# Altium project PCB_Project.PrjPcb (part 4 of 5)
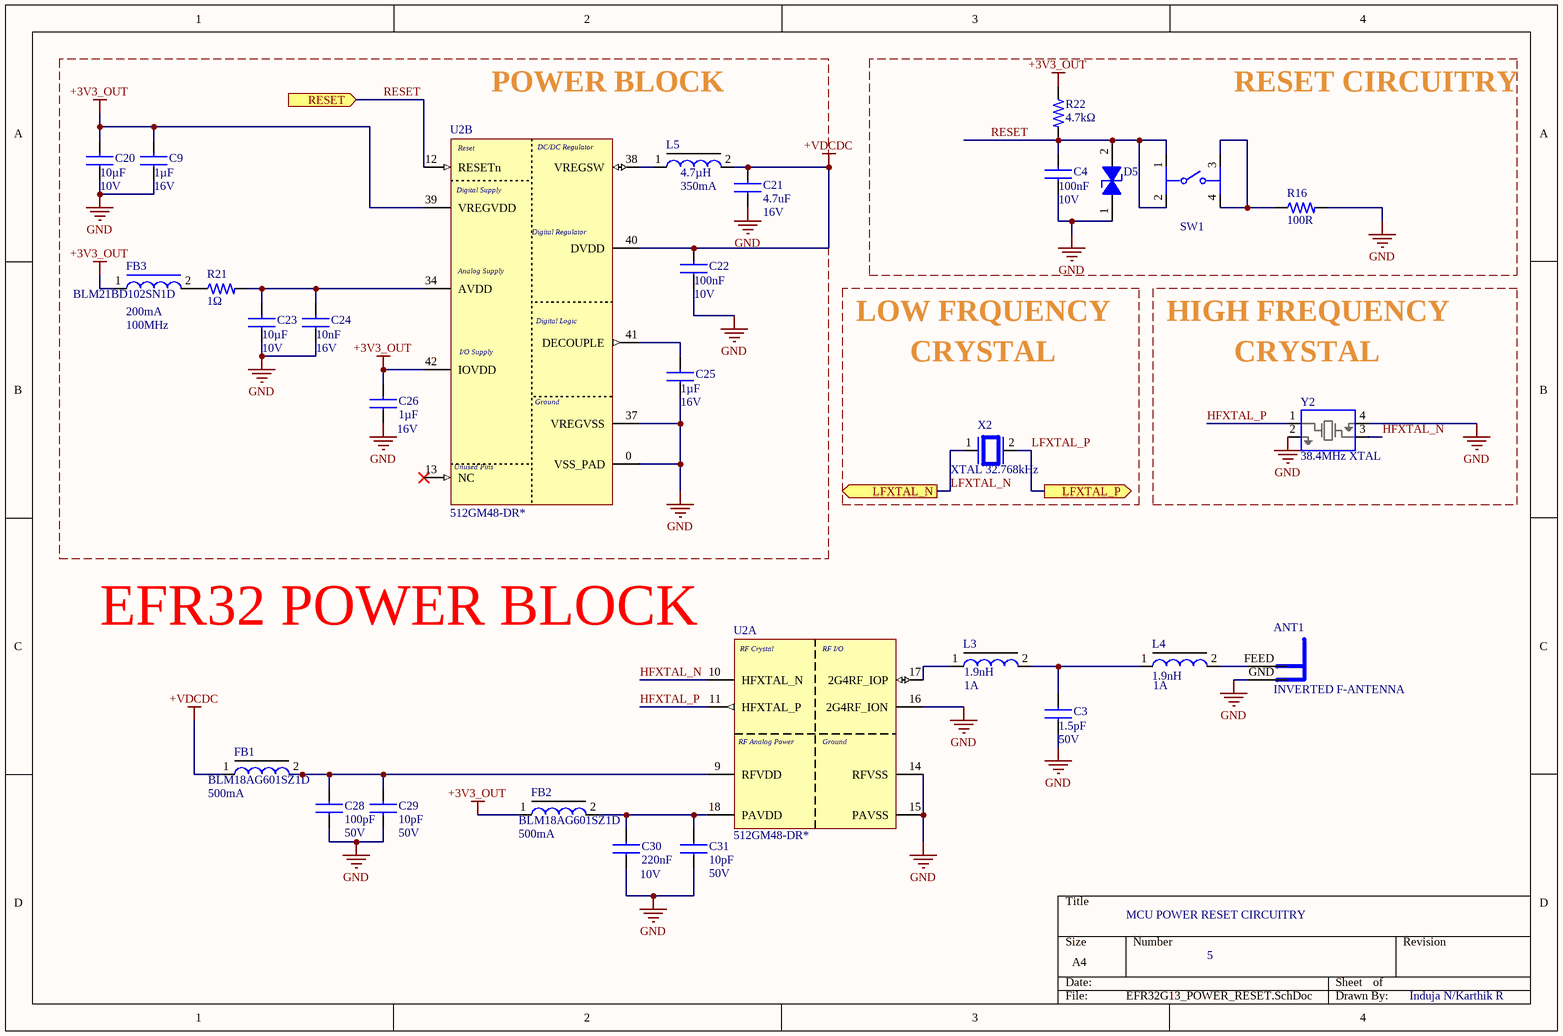
[diagram p9: EFR32G13_POWER_RESET.SchDoc]

## Sheet EFR32G13_POWER_RESET.SchDoc (continued)
### Library data of the parts
C3 = CAP 1.5pF 50V 0402: Ceramic Capacitor, Multilayer, Ceramic, 50V, 3.33% +Tol, 3.33% -Tol, C0G, 30ppm/Cel TC, 0.0000015uF, Surface Mount, 0402; Manufacturer: Murata; Manufacturer Part Number: GJM1555C1H1R5WB01D; Multilayer: Yes; Supplier: Digikey; Supplier Part Number: 490-11199-1-ND; RoHS: Yes; Category: Ceramic Capacitors; Stock: 52422; Pricing: 1=0.16, 10=0.091, 50=0.0634, 100=0.0549, 500=0.04062, 1000=0.03616, 2500=0.03144, 5000=0.02857 (USD); Mounting Technology: Surface Mount; Pins: 2; Dielectric Material: Ceramic; Package Shape: Rectangular; Case/Package: 0402; Terminal Finish: Nickel; Min Operating Temperature: -55°C; Max Operating Temperature: 125°C; JESD-609 Code: e3; Capacitor Type: Ceramic; Tolerance  (fill in as +-): 3.33%; Package Style: SMTMeter; Packaging: Tape and Reel; Tolerance (fill in as +-): 3.33%; Temperature Characteristics Code: C0G; Termination: Wraparound; Length: 1mm; Width: 0.5mm; Height: 0.5mm; Reach SVHC Compliant: Yes; RoHS Compliant: Yes; ComponentLink1URL: https://datasheet.ciiva.com:443/pdfs/VipMasterIC/IC/MURE/MURE-S-A0004378008/MURE-S-A0004383770-1.pdf?src-supplier=IHS+Markit; ComponentLink1Description: https://datasheet.ciiva.com:443/pdfs/VipMasterIC/IC/MURE/MURE-S-A0004378008/MURE-S-A0004383770-1.pdf?src-supplier=IHS+Markit; ComponentLink2URL: https://datasheet.ciiva.com/18183/getdatasheetpartid-312921-18183825.pdf?src-supplier=Verical; ComponentLink2Description: https://datasheet.ciiva.com/18183/getdatasheetpartid-312921-18183825.pdf?src-supplier=Verical
C4 C22 = CAP 0.1uF 0603: 0603 0.1 uF 10 V ±10% Tolerance X7R SMT Multilayer Ceramic Chip Capacitor; Manufacturer: Vishay; Manufacturer Part Number: VJ0603Y104KXQCW1BC; Supplier: Newark; Supplier Part Number: 77AK2911; RoHS: Compliant; Category: Ceramic Capacitors; Stock: 20000; Pricing: 4000=0.028, 8000=0.026 (USD); Case/Package: 0603; Case Code (Imperial): 0603; Case Code (Metric): 1608; China RoHS: Compliant; Depth: 800µm; Dielectric: X7R; Dielectric Material: Ceramic; Height: 870µm; Lead Free: Lead Free; Length: 1.6mm; Lifecycle Status: Production; Max Operating Temperature: 125°C; Min Operating Temperature: -55°C; Mounting Technology: Surface Mount; Number of Terminals: 2; REACH SVHC: Yes; Schedule B: 8532240020, 8532240020|8532240020|8532240020|8532240020|8532240020; Termination: SMD/SMT; Tolerance: 10%; Width: 800µm; ComponentLink1URL: https://datasheet.octopart.com:443/VJ0603Y104KXQCW1BC-Vishay-datasheet-182138897.pdf?src-supplier=IHS; ComponentLink1Description: https://datasheet.octopart.com:443/VJ0603Y104KXQCW1BC-Vishay-datasheet-182138897.pdf?src-supplier=IHS; ComponentLink2URL: https://datasheet.octopart.com:443/VJ0603Y104KXQCW1BC-Vishay-datasheet-182137611.pdf?src-supplier=IHS; ComponentLink2Description: https://datasheet.octopart.com:443/VJ0603Y104KXQCW1BC-Vishay-datasheet-182137611.pdf?src-supplier=IHS; ComponentLink3URL: https://datasheet.octopart.com:443/VJ0603Y104KXQCW1BC-Vishay-datasheet-79783898.pdf?src-supplier=Future+Electronics; ComponentLink3Description: https://datasheet.octopart.com:443/VJ0603Y104KXQCW1BC-Vishay-datasheet-79783898.pdf?src-supplier=Future+Electronics; ComponentLink4URL: https://datasheet.octopart.com/VJ0603Y104KXQCW1BC-Vishay-datasheet-13530908.pdf; ComponentLink4Description: https://datasheet.octopart.com/VJ0603Y104KXQCW1BC-Vishay-datasheet-13530908.pdf; ComponentLink5URL: https://datasheet.octopart.com/VJ0603Y104KXQCW1BC-Vishay-datasheet-13436109.pdf; ComponentLink5Description: https://datasheet.octopart.com/VJ0603Y104KXQCW1BC-Vishay-datasheet-13436109.pdf; ComponentLink6URL: https://datasheet.octopart.com/VJ0603Y104KXQCW1BC-Vishay-datasheet-13168783.pdf; ComponentLink6Description: https://datasheet.octopart.com/VJ0603Y104KXQCW1BC-Vishay-datasheet-13168783.pdf; ComponentLink7URL: https://datasheet.octopart.com/VJ0603Y104KXQCW1BC-Vishay-datasheet-13134009.pdf; ComponentLink7Description: https://datasheet.octopart.com/VJ0603Y104KXQCW1BC-Vishay-datasheet-13134009.pdf; ComponentLink8URL: https://datasheet.octopart.com/VJ0603Y104KXQCW1BC-Vishay-datasheet-13055807.pdf; ComponentLink8Description: https://datasheet.octopart.com/VJ0603Y104KXQCW1BC-Vishay-datasheet-13055807.pdf; ComponentLink9URL: https://datasheet.octopart.com/VJ0603Y104KXQCW1BC-Vishay-datasheet-13029350.pdf; ComponentLink9Description: https://datasheet.octopart.com/VJ0603Y104KXQCW1BC-Vishay-datasheet-13029350.pdf; ComponentLink10URL: https://datasheet.octopart.com/VJ0603Y104KXQCW1BC-Vishay-datasheet-12584848.pdf; ComponentLink10Description: https://datasheet.octopart.com/VJ0603Y104KXQCW1BC-Vishay-datasheet-12584848.pdf; ComponentLink11URL: https://datasheet.octopart.com/VJ0603Y104KXQCW1BC-Vishay-datasheet-12543093.pdf; ComponentLink11Description: https://datasheet.octopart.com/VJ0603Y104KXQCW1BC-Vishay-datasheet-12543093.pdf; ComponentLink12URL: https://datasheet.octopart.com/VJ0603Y104KXQCW1BC-Vishay-datasheet-12532924.pdf; ComponentLink12Description: https://datasheet.octopart.com/VJ0603Y104KXQCW1BC-Vishay-datasheet-12532924.pdf; ComponentLink13URL: https://datasheet.octopart.com/VJ0603Y104KXQCW1BC-Vishay-datasheet-12519409.pdf; ComponentLink13Description: https://datasheet.octopart.com/VJ0603Y104KXQCW1BC-Vishay-datasheet-12519409.pdf; ComponentLink14URL: https://datasheet.octopart.com/VJ0603Y104KXQCW1BC-Vishay-datasheet-12509873.pdf; ComponentLink14Description: https://datasheet.octopart.com/VJ0603Y104KXQCW1BC-Vishay-datasheet-12509873.pdf; ComponentLink15URL: http://sigma.octopart.com:80/rohs_statement/Vishay-company-15.pdf?src-supplier=Compliance+Statements; ComponentLink15Description: http://sigma.octopart.com:80/rohs_statement/Vishay-company-15.pdf?src-supplier=Compliance+Statements; Supplier 1: DigiKey; Supplier Part Number 1: 720-1689-1-ND
C9 C25 C26 = CAP 1uF 0603: 16V 1uF X7R ±10% 0603 Multilayer Ceramic Capacitors MLCC - SMD/SMT ROHS; Manufacturer: Samsung Electro-Mechanics; Manufacturer Part Number: CL10B105KO8NNNC; Supplier: DigiKey; Supplier Part Number: 1276-1019-1-ND; RoHS: Compliant; Category: Ceramic Capacitors; Stock: 1501586; Pricing: 1=0.08, 10=0.011, 50=0.010, 100=0.0088 (USD); Case/Package: 0603; Case Code (Imperial): 0603; Case Code (Metric): 1608; China RoHS: Compliant; Depth: 800µm; Dielectric: X7R; Dielectric Material: Ceramic; Height: 800µm; Lead Free: Lead Free; Length: 1.6mm; Lifecycle Status: Production; Material: Ceramic; Max Operating Temperature: 125°C; Min Operating Temperature: -55°C; Mounting Technology: Surface Mount; Number of Terminals: 2; Radiation Hardening: No; REACH SVHC: Yes; Schedule B: 8532240020, 8532240020|8532240020, 8532240020|8532240020|8532240020, 8532240020|8532240020|8532240020|8532240020; Thickness: 889µm; Tolerance: 10%; Voltage Rating: 16V; Width: 800µm; ComponentLink1URL: https://datasheet.octopart.com:443/CL10B105KO8NNNC-Samsung-Electro-Mechanics-datasheet-137745070.pdf?src-supplier=IHS; ComponentLink1Description: https://datasheet.octopart.com:443/CL10B105KO8NNNC-Samsung-Electro-Mechanics-datasheet-137745070.pdf?src-supplier=IHS; ComponentLink2URL: https://datasheet.octopart.com/CL10B105KO8NNNC-Samsung-Electro-Mechanics-datasheet-8324245.pdf; ComponentLink2Description: https://datasheet.octopart.com/CL10B105KO8NNNC-Samsung-Electro-Mechanics-datasheet-8324245.pdf; ComponentLink3URL: https://datasheet.octopart.com/CL10B105KO8NNNC-Samsung-Electro-Mechanics-datasheet-97040617.pdf; ComponentLink3Description: https://datasheet.octopart.com/CL10B105KO8NNNC-Samsung-Electro-Mechanics-datasheet-97040617.pdf; ComponentLink4URL: https://datasheet.octopart.com/General-Multilayer-Ceramic-Capacitors-Samsung-datasheet-family-111.pdf; ComponentLink4Description: https://datasheet.octopart.com/General-Multilayer-Ceramic-Capacitors-Samsung-datasheet-family-111.pdf; ComponentLink5URL: https://datasheet.octopart.com:443/CL10B105KO8NNNC-Samsung-Electro-Mechanics-datasheet-116890984.pdf?src-supplier=Future+Electronics; ComponentLink5Description: https://datasheet.octopart.com:443/CL10B105KO8NNNC-Samsung-Electro-Mechanics-datasheet-116890984.pdf?src-supplier=Future+Electronics; ComponentLink6URL: https://datasheet.octopart.com:443/CL10B105KO8NNNC-Samsung-Electro-Mechanics-datasheet-81461852.pdf?src-supplier=Future+Electronics; ComponentLink6Description: https://datasheet.octopart.com:443/CL10B105KO8NNNC-Samsung-Electro-Mechanics-datasheet-81461852.pdf?src-supplier=Future+Electronics; ComponentLink7URL: https://datasheet.octopart.com:443/CL10B105KO8NNNC-Samsung-datasheet-42770397.pdf?src-supplier=Future+Electronics; ComponentLink7Description: https://datasheet.octopart.com:443/CL10B105KO8NNNC-Samsung-datasheet-42770397.pdf?src-supplier=Future+Electronics; ComponentLink8URL: https://datasheet.octopart.com:443/CL10B105KO8NNNC-Samsung-datasheet-26669023.pdf?src-supplier=Future+Electronics; ComponentLink8Description: https://datasheet.octopart.com:443/CL10B105KO8NNNC-Samsung-datasheet-26669023.pdf?src-supplier=Future+Electronics; ComponentLink9URL: https://datasheet.octopart.com:443/CL10B105KO8NNNC-Samsung-Electro-Mechanics-datasheet-149136799.pdf?src-supplier=Future+Electronics; ComponentLink9Description: https://datasheet.octopart.com:443/CL10B105KO8NNNC-Samsung-Electro-Mechanics-datasheet-149136799.pdf?src-supplier=Future+Electronics; ComponentLink10URL: https://datasheet.octopart.com:443/CL10B105KO8NNNC-Samsung-datasheet-151956584.pdf?src-supplier=SOS+electronic; ComponentLink10Description: https://datasheet.octopart.com:443/CL10B105KO8NNNC-Samsung-datasheet-151956584.pdf?src-supplier=SOS+electronic; ComponentLink11URL: https://datasheet.octopart.com:443/CL10B105KO8NNNC-Samsung-Electro-Mechanics-datasheet-11774093.pdf?src-supplier=Arrow+Electronics; ComponentLink11Description: https://datasheet.octopart.com:443/CL10B105KO8NNNC-Samsung-Electro-Mechanics-datasheet-11774093.pdf?src-supplier=Arrow+Electronics; ComponentLink12URL: https://datasheet.octopart.com:443/CL10B105KO8NNNC-Samsung-datasheet-59220082.pdf?src-supplier=TME; ComponentLink12Description: https://datasheet.octopart.com:443/CL10B105KO8NNNC-Samsung-datasheet-59220082.pdf?src-supplier=TME; ComponentLink13URL: http://sigma.octopart.com:80/rohs_certificate/General-Multilayer-Ceramic-Capacitors-Samsung-family-110.pdf?src-supplier=Compliance+Statements; ComponentLink13Description: http://sigma.octopart.com:80/rohs_certificate/General-Multilayer-Ceramic-Capacitors-Samsung-family-110.pdf?src-supplier=Compliance+Statements; ComponentLink14URL: http://sigma.octopart.com:80/rohs_statement/General-Multilayer-Ceramic-Capacitors-Samsung-family-132.pdf?src-supplier=Compliance+Statements; ComponentLink14Description: http://sigma.octopart.com:80/rohs_statement/General-Multilayer-Ceramic-Capacitors-Samsung-family-132.pdf?src-supplier=Compliance+Statements; ComponentLink15URL: http://sigma.octopart.com:80/reach_statement/General-Multilayer-Ceramic-Capacitors-Samsung-family-133.pdf?src-supplier=Compliance+Statements; ComponentLink15Description: http://sigma.octopart.com:80/reach_statement/General-Multilayer-Ceramic-Capacitors-Samsung-family-133.pdf?src-supplier=Compliance+Statements; Supplier 1: DigiKey; Supplier Part Number 1: 1276-1019-1-ND
  C9 C26: Voltage Rating (DC): 16V
  C25: Voltage: 16V
C20 C23 = CAP 10uF 0603: 10V 10uF X7R ±10% 0603 Multilayer Ceramic Capacitors MLCC - SMD/SMT ROHS; Manufacturer: Murata; Manufacturer Part Number: GRM188Z71A106KA73D; Manufacturer Lifecycle Status: IN PRODUCTION; Supplier: Avnet; Supplier Part Number: GRM188Z71A106KA73D; RoHS: Compliant; Category: Ceramic Capacitors; Stock: 36000; Pricing: 4000=0.04684, 8000=0.04661, 16000=0.04637, 24000=0.04613, 32000=0.04589 (USD); Case/Package: 0603; Dielectric Material: Ceramic; Height: 800µm; Length: 1.6mm; Lifecycle Status: Production; Material: Ceramic; Max Operating Temperature: 125°C; Min Operating Temperature: -55°C; Mounting Technology: Surface Mount; Number of Terminals: 2; REACH SVHC: Yes; Schedule B: 8532240020, 8532240020|8532240020|8532240020|8532240020|8532240020; Thickness: 800µm; Tolerance: 10%; Voltage Rating (DC): 10V; Width: 800µm; ComponentLink1URL: https://datasheet.octopart.com:443/GRM188Z71A106KA73D-Murata-datasheet-141276001.pdf?src-supplier=Geoflip; ComponentLink1Description: https://datasheet.octopart.com:443/GRM188Z71A106KA73D-Murata-datasheet-141276001.pdf?src-supplier=Geoflip; ComponentLink2URL: https://datasheet.octopart.com:443/GRM188Z71A106KA73D-Murata-datasheet-165579666.pdf?src-supplier=TME; ComponentLink2Description: https://datasheet.octopart.com:443/GRM188Z71A106KA73D-Murata-datasheet-165579666.pdf?src-supplier=TME; ComponentLink3URL: https://datasheet.octopart.com:443/GRM188Z71A106KA73D-Murata-datasheet-140705911.pdf?src-supplier=Ciiva; ComponentLink3Description: https://datasheet.octopart.com:443/GRM188Z71A106KA73D-Murata-datasheet-140705911.pdf?src-supplier=Ciiva; ComponentLink4URL: https://datasheet.octopart.com:443/GRM188Z71A106KA73D-Murata-datasheet-138743429.pdf?src-supplier=Ciiva; ComponentLink4Description: https://datasheet.octopart.com:443/GRM188Z71A106KA73D-Murata-datasheet-138743429.pdf?src-supplier=Ciiva; ComponentLink5URL: http://sigma.octopart.com:80/reach_statement/Murata-company-16.pdf?src-supplier=Compliance+Statements; ComponentLink5Description: http://sigma.octopart.com:80/reach_statement/Murata-company-16.pdf?src-supplier=Compliance+Statements; Supplier 1: DigiKey; Supplier Part Number 1: 490-GRM188Z71A106KA73DCT-ND
C21 = CAP 4.7uF 16V 0603: 4.7 ÂµF Â±10% 16V Ceramic Capacitor X5R 0603 (1608 Metric); MF: Samsung Electro-Mechanics; MP: CL10A475KO8NNNC; SnapEDA_Link: https://www.snapeda.com/parts/CL10A475KO8NNNC/Samsung/view-part/?ref=snap; Package: SMD-2 Samsung; Check_prices: https://www.snapeda.com/parts/CL10A475KO8NNNC/Samsung/view-part/?ref=eda; Supplier 1: DigiKey; Supplier Part Number 1: 1276-1784-1-ND
C24 = CAP 10nF 0603: Multilayer Ceramic Capacitors MLCC - SMD/SMT 16V 0.01uF X7R 0603 10% AEC-Q200; Manufacturer: KEMET; Manufacturer Part Number: C0603C103K4RECAUTO; Supplier: Newark; Supplier Part Number: 76AH8427; RoHS: Compliant; Category: Ceramic Capacitors; Stock: 3130; Pricing: 1=0.02, 25=0.02, 50=0.02, 100=0.02, 250=0.02, 500=0.02, 1000=0.02 (USD); China RoHS: Compliant; Dielectric: X7R; Dielectric Material: Ceramic; Height: 800µm; Length: 1.6mm; Lifecycle Status: Production; Max Operating Temperature: 125°C; Min Operating Temperature: -55°C; Mounting Technology: Surface Mount; Number of Terminals: 2; REACH SVHC: Yes; Schedule B: 8532240020, 8532240020|8532240020, 8532240020|8532240020|8532240020, 8532240020|8532240020|8532240020|8532240020; Width: 800µm; ComponentLink1URL: https://datasheet.octopart.com:443/C0603C103K4RECAUTO-KEMET-datasheet-178568699.pdf?src-supplier=IHS; ComponentLink1Description: https://datasheet.octopart.com:443/C0603C103K4RECAUTO-KEMET-datasheet-178568699.pdf?src-supplier=IHS; ComponentLink2URL: https://datasheet.octopart.com:443/C0603C103K4RECAUTO-KEMET-datasheet-189767465.pdf?src-supplier=ODG+(Origin+Data+Global); ComponentLink2Description: https://datasheet.octopart.com:443/C0603C103K4RECAUTO-KEMET-datasheet-189767465.pdf?src-supplier=ODG+(Origin+Data+Global); ComponentLink3URL: https://datasheet.octopart.com:443/C0603C103K4RECAUTO-KEMET-datasheet-149521825.pdf?src-supplier=Farnell; ComponentLink3Description: https://datasheet.octopart.com:443/C0603C103K4RECAUTO-KEMET-datasheet-149521825.pdf?src-supplier=Farnell; ComponentLink4URL: https://datasheet.octopart.com:443/C0603C103K4RECAUTO-KEMET-datasheet-153706760.pdf?src-supplier=Farnell; ComponentLink4Description: https://datasheet.octopart.com:443/C0603C103K4RECAUTO-KEMET-datasheet-153706760.pdf?src-supplier=Farnell; ComponentLink5URL: https://datasheet.octopart.com:443/C0603C103K4RECAUTO-KEMET-datasheet-153410967.pdf?src-supplier=Electro+Sonic; ComponentLink5Description: https://datasheet.octopart.com:443/C0603C103K4RECAUTO-KEMET-datasheet-153410967.pdf?src-supplier=Electro+Sonic; ComponentLink6URL: https://datasheet.octopart.com:443/C0603C103K4RECAUTO-KEMET-datasheet-176334325.pdf?src-supplier=Newark; ComponentLink6Description: https://datasheet.octopart.com:443/C0603C103K4RECAUTO-KEMET-datasheet-176334325.pdf?src-supplier=Newark; ComponentLink7URL: https://datasheet.octopart.com:443/C0603C103K4RECAUTO-KEMET-datasheet-158241778.pdf?src-supplier=TME; ComponentLink7Description: https://datasheet.octopart.com:443/C0603C103K4RECAUTO-KEMET-datasheet-158241778.pdf?src-supplier=TME; Supplier 1: DigiKey; Supplier Part Number 1: 399-17880-1-ND
C28 = CAP 100pF 0603: 50V 100pF NP0 ±5% 0603 Multilayer Ceramic Capacitors MLCC - SMD/SMT ROHS; Manufacturer: Yageo Group; Manufacturer Part Number: CC0603JRNPO9BN101; Dielectric: C0G; Insulation Resistance: 100GΩ; Temperature Coefficient: 30ppm/°C; Supplier: Avnet; Supplier Part Number: CC0603JRNPO9BN101; RoHS: Compliant; Category: Ceramic Capacitors; Stock: 1204000; Pricing: 4000=0.0038, 8000=0.00371, 16000=0.00364, 24000=0.00357, 32000=0.00351 (USD); Case/Package: 0603; Case Code (Imperial): 0603; China RoHS: Compliant; Composition: Ceramic; Depth: 800µm; Dielectric Material: Ceramic; Halogen Free: Halogen Free; Height: 800µm; Lead Free: Lead Free; Length: 1.6mm; Lifecycle Status: Production; Max Operating Temperature: 125°C; Min Operating Temperature: -55°C; Mounting Technology: Surface Mount; Pins: 2; Number of Terminals: 2; Radiation Hardening: No; REACH SVHC: Yes; Schedule B: 8532240020, 8532240020|8532240020|8532240020|8532240020|8532240020|8532240020|8532240020|8532240020|8532240020|8532240020|8532240020|8532240020|8532240020|8532240020|8532240020|8532240020|8532240020|8532240020|8532240020|8532240020|8532240020|8532240020|8532240020|85; Termination: SMD/SMT; Thickness: 889µm; Tolerance: 5%; Voltage: 50V; Voltage Rating: 50V; Voltage Rating (AC): 50V; Width: 800µm; ComponentLink1URL: https://datasheet.octopart.com:443/CC0603JRNPO9BN101-Yageo-datasheet-182140217.pdf?src-supplier=IHS; ComponentLink1Description: https://datasheet.octopart.com:443/CC0603JRNPO9BN101-Yageo-datasheet-182140217.pdf?src-supplier=IHS; ComponentLink2URL: https://datasheet.octopart.com:443/CC0603JRNPO9BN101-Yageo-datasheet-78855684.pdf?src-supplier=Upverter; ComponentLink2Description: https://datasheet.octopart.com:443/CC0603JRNPO9BN101-Yageo-datasheet-78855684.pdf?src-supplier=Upverter; ComponentLink3URL: https://datasheet.octopart.com:443/CC0603JRNPO9BN101-Yageo-datasheet-10406438.pdf?src-supplier=element14+APAC; ComponentLink3Description: https://datasheet.octopart.com:443/CC0603JRNPO9BN101-Yageo-datasheet-10406438.pdf?src-supplier=element14+APAC; ComponentLink4URL: https://datasheet.octopart.com:443/CC0603JRNPO9BN101-Yageo-datasheet-151948684.pdf?src-supplier=Newark; ComponentLink4Description: https://datasheet.octopart.com:443/CC0603JRNPO9BN101-Yageo-datasheet-151948684.pdf?src-supplier=Newark; ComponentLink5URL: https://datasheet.octopart.com:443/CC0603JRNPO9BN101-Yageo-datasheet-24578986.pdf?src-supplier=Newark; ComponentLink5Description: https://datasheet.octopart.com:443/CC0603JRNPO9BN101-Yageo-datasheet-24578986.pdf?src-supplier=Newark; ComponentLink6URL: https://datasheet.octopart.com:443/CC0603JRNPO9BN101-Phycomp-datasheet-504625.pdf?src-supplier=Newark; ComponentLink6Description: https://datasheet.octopart.com:443/CC0603JRNPO9BN101-Phycomp-datasheet-504625.pdf?src-supplier=Newark; ComponentLink7URL: https://datasheet.octopart.com:443/CC0603JRNPO9BN101-Yageo-datasheet-181968162.pdf?src-supplier=Newark; ComponentLink7Description: https://datasheet.octopart.com:443/CC0603JRNPO9BN101-Yageo-datasheet-181968162.pdf?src-supplier=Newark; ComponentLink8URL: https://datasheet.octopart.com:443/CC0603JRNPO9BN101-Yageo-datasheet-181968163.pdf?src-supplier=Newark; ComponentLink8Description: https://datasheet.octopart.com:443/CC0603JRNPO9BN101-Yageo-datasheet-181968163.pdf?src-supplier=Newark; ComponentLink9URL: https://datasheet.octopart.com:443/CC0603JRNPO9BN101-Yageo-datasheet-67645495.pdf?src-supplier=Newark; ComponentLink9Description: https://datasheet.octopart.com:443/CC0603JRNPO9BN101-Yageo-datasheet-67645495.pdf?src-supplier=Newark; ComponentLink10URL: https://datasheet.octopart.com:443/CC0603JRNPO9BN101-Phycomp-datasheet-5321569.pdf?src-supplier=element14; ComponentLink10Description: https://datasheet.octopart.com:443/CC0603JRNPO9BN101-Phycomp-datasheet-5321569.pdf?src-supplier=element14; ComponentLink11URL: https://datasheet.octopart.com:443/CC0603JRNPO9BN101-Yageo-datasheet-8817079.pdf?src-supplier=element14; ComponentLink11Description: https://datasheet.octopart.com:443/CC0603JRNPO9BN101-Yageo-datasheet-8817079.pdf?src-supplier=element14; ComponentLink12URL: https://datasheet.octopart.com:443/CC0603JRNPO9BN101-Yageo-datasheet-8324240.pdf?src-supplier=element14; ComponentLink12Description: https://datasheet.octopart.com:443/CC0603JRNPO9BN101-Yageo-datasheet-8324240.pdf?src-supplier=element14; ComponentLink13URL: https://datasheet.octopart.com:443/CC0603JRNPO9BN101-Yageo-datasheet-65873193.pdf?src-supplier=Farnell; ComponentLink13Description: https://datasheet.octopart.com:443/CC0603JRNPO9BN101-Yageo-datasheet-65873193.pdf?src-supplier=Farnell; ComponentLink14URL: https://datasheet.octopart.com:443/CC0603JRNPO9BN101-Yageo-datasheet-137875056.pdf?src-supplier=Future+Electronics; ComponentLink14Description: https://datasheet.octopart.com:443/CC0603JRNPO9BN101-Yageo-datasheet-137875056.pdf?src-supplier=Future+Electronics; ComponentLink15URL: https://datasheet.octopart.com:443/CC0603JRNPO9BN101-Yageo-datasheet-136957424.pdf?src-supplier=Future+Electronics; ComponentLink15Description: https://datasheet.octopart.com:443/CC0603JRNPO9BN101-Yageo-datasheet-136957424.pdf?src-supplier=Future+Electronics; ComponentLink16URL: https://datasheet.octopart.com:443/CC0603JRNPO9BN101-Yageo-datasheet-137700082.pdf?src-supplier=Future+Electronics; ComponentLink16Description: https://datasheet.octopart.com:443/CC0603JRNPO9BN101-Yageo-datasheet-137700082.pdf?src-supplier=Future+Electronics; ComponentLink17URL: https://datasheet.octopart.com:443/CC0603JRNPO9BN101-Yageo-datasheet-62091628.pdf?src-supplier=Future+Electronics; ComponentLink17Description: https://datasheet.octopart.com:443/CC0603JRNPO9BN101-Yageo-datasheet-62091628.pdf?src-supplier=Future+Electronics; ComponentLink18URL: https://datasheet.octopart.com:443/CC0603JRNPO9BN101-Yageo-datasheet-16730043.pdf?src-supplier=Future+Electronics; ComponentLink18Description: https://datasheet.octopart.com:443/CC0603JRNPO9BN101-Yageo-datasheet-16730043.pdf?src-supplier=Future+Electronics; ComponentLink19URL: https://datasheet.octopart.com:443/CC0603JRNPO9BN101-Yageo-datasheet-15895757.pdf?src-supplier=Future+Electronics; ComponentLink19Description: https://datasheet.octopart.com:443/CC0603JRNPO9BN101-Yageo-datasheet-15895757.pdf?src-supplier=Future+Electronics; ComponentLink20URL: https://datasheet.octopart.com:443/CC0603JRNPO9BN101-Yageo-datasheet-12589826.pdf?src-supplier=Future+Electronics; ComponentLink20Description: https://datasheet.octopart.com:443/CC0603JRNPO9BN101-Yageo-datasheet-12589826.pdf?src-supplier=Future+Electronics; ComponentLink21URL: https://datasheet.octopart.com:443/CC0603JRNPO9BN101-Yageo-datasheet-8555986.pdf?src-supplier=TME; ComponentLink21Description: https://datasheet.octopart.com:443/CC0603JRNPO9BN101-Yageo-datasheet-8555986.pdf?src-supplier=TME; ComponentLink22URL: https://datasheet.octopart.com:443/CC0603JRNPO9BN101-Yageo-datasheet-8643175.pdf?src-supplier=SOS+electronic; ComponentLink22Description: https://datasheet.octopart.com:443/CC0603JRNPO9BN101-Yageo-datasheet-8643175.pdf?src-supplier=SOS+electronic; ComponentLink23URL: https://datasheet.octopart.com:443/CC0603JRNPO9BN101-Yageo-datasheet-68296204.pdf?src-supplier=Megastar; ComponentLink23Description: https://datasheet.octopart.com:443/CC0603JRNPO9BN101-Yageo-datasheet-68296204.pdf?src-supplier=Megastar; ComponentLink24URL: http://sigma.octopart.com:80/rohs_statement/Yageo-company-2.pdf?src-supplier=Compliance+Statements; ComponentLink24Description: http://sigma.octopart.com:80/rohs_statement/Yageo-company-2.pdf?src-supplier=Compliance+Statements; ComponentLink25URL: http://sigma.octopart.com:80/conflict_mineral_statement/Yageo-company-3.pdf?src-supplier=Compliance+Statements; ComponentLink25Description: http://sigma.octopart.com:80/conflict_mineral_statement/Yageo-company-3.pdf?src-supplier=Compliance+Statements; Supplier 1: DigiKey; Supplier Part Number 1: 311-1069-1-ND
C29 C31 = CAP 10pF 50V 0603: Ceramic Capacitor, Multilayer, Ceramic, 100V, 5% +Tol, 5% -Tol, C0G, 30ppm/Cel TC, 0.00001uF, Surface Mount, 0603; Manufacturer: Murata; Manufacturer Part Number: GRM1555C1H100FA01D; Multilayer: Yes; Tolerance  (fill in as +-): 1%; Reference Standard: AEC-Q200; Supplier: Digikey; Supplier Part Number: 490-6186-1-ND; RoHS: Yes; Category: Ceramic Capacitors; Stock: 4693307; Pricing: 1=0.1, 10=0.03, 50=0.0204, 100=0.0174, 500=0.0125, 1000=0.01097, 2500=0.00936, 5000=0.00838 (USD); Mounting Technology: Surface Mount; Pins: 2; Dielectric Material: Ceramic; Package Shape: Rectangular; Case/Package: 0402; Terminal Finish: Nickel; Min Operating Temperature: -55°C; Max Operating Temperature: 125°C; JESD-609 Code: e3; Capacitor Type: Ceramic; Packaging: Tape and Reel; Tolerance (fill in as +-): 1%; Temperature Characteristics Code: C0G; Termination: Wraparound; Reach SVHC Compliant: Yes; RoHS Compliant: Yes; ComponentLink1URL: https://datasheet.ciiva.com:443/pdfs/VipMasterIC/IC/MURE/MURE-S-A0004347008/MURE-S-A0004347294-1.pdf?src-supplier=IHS+Markit; ComponentLink1Description: https://datasheet.ciiva.com:443/pdfs/VipMasterIC/IC/MURE/MURE-S-A0004347008/MURE-S-A0004347294-1.pdf?src-supplier=IHS+Markit; ComponentLink2URL: https://datasheet.ciiva.com/6263/partnumbering-e-01-6263819.pdf?src-supplier=Digikey; ComponentLink2Description: https://datasheet.ciiva.com/6263/partnumbering-e-01-6263819.pdf?src-supplier=Digikey; ComponentLink3URL: https://datasheet.ciiva.com/6263/partnumbering-e-01-6263822.pdf?src-supplier=Digikey; ComponentLink3Description: https://datasheet.ciiva.com/6263/partnumbering-e-01-6263822.pdf?src-supplier=Digikey; Package Style: SMTMeter; Length: 1.6mm; Width: 0.8mm; Height: 0.9mm; ComponentLink4URL: https://datasheet.ciiva.com:443/pdfs/VipMasterIC/IC/MURE/MURE-S-A0004365318/MURE-S-A0004370306-1.pdf?src-supplier=IHS+Markit; ComponentLink4Description: https://datasheet.ciiva.com:443/pdfs/VipMasterIC/IC/MURE/MURE-S-A0004365318/MURE-S-A0004370306-1.pdf?src-supplier=IHS+Markit; ComponentLink5URL: https://datasheet.ciiva.com/133/product-133480.pdf?src-supplier=Digikey; ComponentLink5Description: https://datasheet.ciiva.com/133/product-133480.pdf?src-supplier=Digikey; ComponentLink6URL: https://datasheet.ciiva.com/133/product-133481.pdf?src-supplier=Digikey; ComponentLink6Description: https://datasheet.ciiva.com/133/product-133481.pdf?src-supplier=Digikey; ComponentLink7URL: https://datasheet.ciiva.com/133/product-133482.pdf?src-supplier=Digikey; ComponentLink7Description: https://datasheet.ciiva.com/133/product-133482.pdf?src-supplier=Digikey; ComponentLink8URL: https://datasheet.ciiva.com/18183/getdatasheetpartid-307287-18183583.pdf?src-supplier=Verical; ComponentLink8Description: https://datasheet.ciiva.com/18183/getdatasheetpartid-307287-18183583.pdf?src-supplier=Verical; ComponentLink9URL: https://datasheet.ciiva.com/11607/product-11607353.pdf?src-supplier=Avnet; ComponentLink9Description: https://datasheet.ciiva.com/11607/product-11607353.pdf?src-supplier=Avnet; Supplier 1: DigiKey; Supplier Part Number 1: 490-6186-1-ND
C30 = CAP 220nF 10V 0603: 0603 0.22 uF 10 V ±10% Tolerance X7R SMT Multilayer Ceramic Capacitor; Manufacturer: Murata; Manufacturer Part Number: GRM188R71A224KA01J; Manufacturer Lifecycle Status: NRND; Supplier: Arrow Electronics; Supplier Part Number: GRM188R71A224KA01J; RoHS: Compliant; Category: Ceramic Capacitors; Stock: 100000; Pricing: 1=0.0224, 10=0.022, 1000=0.022, 30000=0.022 (USD); Case/Package: 0603; Case Code (Imperial): 0603; Case Code (Metric): 1608; Depth: 800µm; Dielectric: X7R; Dielectric Material: Ceramic; Height: 800µm; Lead Free: Lead Free; Length: 1.6mm; Lifecycle Status: NRND; Material: Ceramic; Max Operating Temperature: 125°C; Min Operating Temperature: -55°C; Mounting Technology: Surface Mount; Number of Terminals: 2; Radiation Hardening: No; REACH SVHC: Yes; Schedule B: 8532240020, 8532240020|8532240020, 8532240020|8532240020|8532240020, 8532240020|8532240020|8532240020|8532240020; Termination: SMD/SMT; Thickness: 800µm; Tolerance: 10%; Voltage Rating (DC): 10V; Width: 800µm; ComponentLink1URL: https://datasheet.octopart.com:443/GRM188R71A224KA01J-Murata-datasheet-14401092.pdf?src-supplier=Future+Electronics; ComponentLink1Description: https://datasheet.octopart.com:443/GRM188R71A224KA01J-Murata-datasheet-14401092.pdf?src-supplier=Future+Electronics; ComponentLink2URL: https://datasheet.octopart.com:443/GRM188R71A224KA01J-Murata-datasheet-22122223.pdf?src-supplier=Future+Electronics; ComponentLink2Description: https://datasheet.octopart.com:443/GRM188R71A224KA01J-Murata-datasheet-22122223.pdf?src-supplier=Future+Electronics; ComponentLink3URL: https://datasheet.octopart.com:443/GRM188R71A224KA01J-Murata-datasheet-11801259.pdf?src-supplier=Future+Electronics; ComponentLink3Description: https://datasheet.octopart.com:443/GRM188R71A224KA01J-Murata-datasheet-11801259.pdf?src-supplier=Future+Electronics; ComponentLink4URL: https://datasheet.octopart.com:443/GRM188R71A224KA01J-Murata-datasheet-8330557.pdf?src-supplier=Future+Electronics; ComponentLink4Description: https://datasheet.octopart.com:443/GRM188R71A224KA01J-Murata-datasheet-8330557.pdf?src-supplier=Future+Electronics; ComponentLink5URL: https://datasheet.octopart.com:443/GRM188R71A224KA01J-Murata-datasheet-44107669.pdf?src-supplier=Future+Electronics; ComponentLink5Description: https://datasheet.octopart.com:443/GRM188R71A224KA01J-Murata-datasheet-44107669.pdf?src-supplier=Future+Electronics; ComponentLink6URL: https://datasheet.octopart.com:443/GRM188R71A224KA01J-Murata-datasheet-141274968.pdf?src-supplier=Ciiva; ComponentLink6Description: https://datasheet.octopart.com:443/GRM188R71A224KA01J-Murata-datasheet-141274968.pdf?src-supplier=Ciiva; ComponentLink7URL: https://datasheet.octopart.com:443/GRM188R71A224KA01J-Murata-datasheet-140705377.pdf?src-supplier=Ciiva; ComponentLink7Description: https://datasheet.octopart.com:443/GRM188R71A224KA01J-Murata-datasheet-140705377.pdf?src-supplier=Ciiva; ComponentLink8URL: https://datasheet.octopart.com:443/GRM188R71A224KA01J-Murata-datasheet-138742946.pdf?src-supplier=Ciiva; ComponentLink8Description: https://datasheet.octopart.com:443/GRM188R71A224KA01J-Murata-datasheet-138742946.pdf?src-supplier=Ciiva; ComponentLink9URL: https://datasheet.octopart.com/GRM188R71A224KA01J-Murata-datasheet-12515295.pdf; ComponentLink9Description: https://datasheet.octopart.com/GRM188R71A224KA01J-Murata-datasheet-12515295.pdf; ComponentLink10URL: https://datasheet.octopart.com/GRM188R71A224KA01J-Murata-datasheet-12510076.pdf; ComponentLink10Description: https://datasheet.octopart.com/GRM188R71A224KA01J-Murata-datasheet-12510076.pdf; ComponentLink11URL: https://datasheet.octopart.com/GRM188R71A224KA01J-Murata-datasheet-11978611.pdf; ComponentLink11Description: https://datasheet.octopart.com/GRM188R71A224KA01J-Murata-datasheet-11978611.pdf; ComponentLink12URL: https://datasheet.octopart.com/GRM188R71A224KA01J-Murata-datasheet-10025737.pdf; ComponentLink12Description: https://datasheet.octopart.com/GRM188R71A224KA01J-Murata-datasheet-10025737.pdf; ComponentLink13URL: https://datasheet.octopart.com/GRM188R71A224KA01J-Murata-datasheet-8819587.pdf; ComponentLink13Description: https://datasheet.octopart.com/GRM188R71A224KA01J-Murata-datasheet-8819587.pdf; ComponentLink14URL: http://sigma.octopart.com:80/reach_statement/Murata-company-16.pdf?src-supplier=Compliance+Statements; ComponentLink14Description: http://sigma.octopart.com:80/reach_statement/Murata-company-16.pdf?src-supplier=Compliance+Statements
D5 = TVS Diode ESD Protection: 824032815 Tvs Diode, Bidir, 5V, Dfn1610 Rohs Compliant: Yes |Wurth Elektronik 824032815; NexarPartId: 133963841; Min Operating Temperature: -55°C; Width: 1mm; Length: 1.6mm; RoHS: Compliant; Max Operating Temperature: 85°C; Height: 500µm; Supplier 1: DigiKey; Supplier Part Number 1: 732-824032815CT-ND
FB1 FB2 = 600R Ferrite bead: Chip Ferrite Bead, 0603, 600Ω @ 100MHz, 0.38Ω, 25%, 500mA CMP-06046-002436-1; Number of Lines: 1; DC Resistance (DCR): 380mR; Min Operating Temperature: -55°C; Packaging: Cut Tape; Max Operating Temperature: 125°C; Case/Package: 0603; Case Code (Metric): 1608; Case Code (Imperial): 0603; Mount: Surface Mount; RoHS Compliant: Yes; Supplier 1: DigiKey
  FB1: Supplier Part Number 1: 490-14396-6-ND
  FB2: Supplier Part Number 1: 490-14396-1-ND
FB3 = BLM21BD102SN1D: Ferrite Beads Multi-Layer 1KOhm 25% 100MHz 250mA 400mOhm DCR 0805 T/R; Manufacturer: Murata; DC Resistance (DCR): 400mΩ; Impedance: 1kΩ; Material: Steel; Number of Circuits: 1; Value: 400mΩ; Shielding: Unshielded; Supplier: Newark; Supplier Part Number: 73M9146; Manufacturer Part Number: BLM21BD102SN1D; RoHS: Compliant; Category: Ferrite Beads and Chips; Stock: 7170; Pricing: 10=0.119, 25=0.105, 50=0.095, 100=0.086, 250=0.075, 500=0.067, 1000=0.054 (USD); Case/Package: 0805; Case Code (Imperial): 0805; Case Code (Metric): 2012; Core Material: Ferrite; DC Current: 200mA; Depth: 1.25mm; Frequency: 100MHz; Height: 850µm; Lead Free: Lead Free; Length: 2mm; Lifecycle Status: Production; Max Current Rating: 250mA; Max DC Current: 200mA; Clock Frequency: 100MHz; Max Operating Temperature: 125°C; Military Standard: Not; Min Operating Temperature: -55°C; Number of Lines: 1; Pins: 2; Number of Terminals: 2; Packaging: Tape and Reel; Radiation Hardening: No; REACH SVHC: Yes; RMS Current (Irms): 250mA; Schedule B: 8504500000, 8504500000|8504500000|8504500000|8504500000|8504500000; ESR: 400mΩ; Termination: SMD/SMT; Tolerance: 25%; Weight: 5.499807mg; Width: 1.25mm; ComponentLink1URL: https://datasheet.octopart.com:443/BLM21BD102SN1D-Murata-datasheet-12522583.pdf?src-supplier=Upverter; ComponentLink1Description: https://datasheet.octopart.com:443/BLM21BD102SN1D-Murata-datasheet-12522583.pdf?src-supplier=Upverter; ComponentLink2URL: https://datasheet.octopart.com:443/BLM21BD102SN1D-Murata-datasheet-10083551.pdf?src-supplier=Upverter; ComponentLink2Description: https://datasheet.octopart.com:443/BLM21BD102SN1D-Murata-datasheet-10083551.pdf?src-supplier=Upverter; ComponentLink3URL: https://datasheet.octopart.com:443/BLM21BD102SN1D-Murata-datasheet-8508678.pdf?src-supplier=Upverter; ComponentLink3Description: https://datasheet.octopart.com:443/BLM21BD102SN1D-Murata-datasheet-8508678.pdf?src-supplier=Upverter; ComponentLink4URL: https://datasheet.octopart.com:443/BLM21BD102SN1D-Murata-datasheet-166171482.pdf?src-supplier=IHS; ComponentLink4Description: https://datasheet.octopart.com:443/BLM21BD102SN1D-Murata-datasheet-166171482.pdf?src-supplier=IHS; ComponentLink5URL: https://datasheet.octopart.com:443/BLM21BD102SN1D-Murata-datasheet-13283.pdf?src-supplier=element14+APAC; ComponentLink5Description: https://datasheet.octopart.com:443/BLM21BD102SN1D-Murata-datasheet-13283.pdf?src-supplier=element14+APAC; ComponentLink6URL: https://datasheet.octopart.com:443/BLM21BD102SN1D-Murata-datasheet-11600838.pdf?src-supplier=_legacy+Avnet; ComponentLink6Description: https://datasheet.octopart.com:443/BLM21BD102SN1D-Murata-datasheet-11600838.pdf?src-supplier=_legacy+Avnet; ComponentLink7URL: https://datasheet.octopart.com:443/BLM21BD102SN1D-Murata-datasheet-5333885.pdf?src-supplier=_legacy+Avnet; ComponentLink7Description: https://datasheet.octopart.com:443/BLM21BD102SN1D-Murata-datasheet-5333885.pdf?src-supplier=_legacy+Avnet; ComponentLink8URL: https://datasheet.octopart.com:443/BLM21BD102SN1D-Murata-datasheet-141258105.pdf?src-supplier=Ciiva; ComponentLink8Description: https://datasheet.octopart.com:443/BLM21BD102SN1D-Murata-datasheet-141258105.pdf?src-supplier=Ciiva; ComponentLink9URL: https://datasheet.octopart.com:443/BLM21BD102SN1D-Murata-datasheet-138707338.pdf?src-supplier=Ciiva; ComponentLink9Description: https://datasheet.octopart.com:443/BLM21BD102SN1D-Murata-datasheet-138707338.pdf?src-supplier=Ciiva; ComponentLink10URL: https://datasheet.octopart.com:443/BLM21BD102SN1D-Murata-datasheet-155323212.pdf?src-supplier=TME; ComponentLink10Description: https://datasheet.octopart.com:443/BLM21BD102SN1D-Murata-datasheet-155323212.pdf?src-supplier=TME; ComponentLink11URL: https://datasheet.octopart.com:443/BLM21BD102SN1D-Murata-datasheet-22147371.pdf?src-supplier=TME; ComponentLink11Description: https://datasheet.octopart.com:443/BLM21BD102SN1D-Murata-datasheet-22147371.pdf?src-supplier=TME; ComponentLink12URL: https://datasheet.octopart.com:443/BLM21BD102SN1D-Murata-datasheet-62086368.pdf?src-supplier=Future+Electronics; ComponentLink12Description: https://datasheet.octopart.com:443/BLM21BD102SN1D-Murata-datasheet-62086368.pdf?src-supplier=Future+Electronics; ComponentLink13URL: https://datasheet.octopart.com/BLM21BD102SN1D-Murata-datasheet-37129980.pdf; ComponentLink13Description: https://datasheet.octopart.com/BLM21BD102SN1D-Murata-datasheet-37129980.pdf; ComponentLink14URL: https://datasheet.octopart.com:443/BLM21BD102SN1D-Murata-datasheet-80921.pdf?src-supplier=RS+(Formerly+Allied+Electronics); ComponentLink14Description: https://datasheet.octopart.com:443/BLM21BD102SN1D-Murata-datasheet-80921.pdf?src-supplier=RS+(Formerly+Allied+Electronics); ComponentLink15URL: http://sigma.octopart.com:80/reach_statement/Murata-company-16.pdf?src-supplier=Compliance+Statements; ComponentLink15Description: http://sigma.octopart.com:80/reach_statement/Murata-company-16.pdf?src-supplier=Compliance+Statements
L3 L4 = IND 1.9nH: Inductor, 1.9Nh, 8Ghz, 0402 Rohs Compliant: Yes |Murata LQG15WZ1N9S02D; Manufacturer: Murata; Manufacturer Lifecycle Status: IN PRODUCTION; Core Material: Air; DC Resistance (DCR): 50mΩ; Number of Circuits: 1; Q Factor: 23; Shielding: No; Test Frequency: 250MHz; Tolerance: 15.79%; Supplier: Newark; Supplier Part Number: 24AJ0906; Manufacturer Part Number: LQG15WZ1N9S02D; RoHS: Compliant; Category: Fixed Inductors; Stock: 3275; Pricing: 10=0.078, 25=0.069, 50=0.067, 100=0.065, 250=0.057, 500=0.056, 1000=0.054 (USD); Case/Package: 0402; Height: 500µm; Lifecycle Status: Production; Max Current Rating: 1A; Max Operating Temperature: 125°C; Min Operating Temperature: -55°C; Number of Terminals: 2; REACH SVHC: Yes; RMS Current (Irms): 1A; Self Resonant Frequency: 8GHz; ESR: 50mΩ; Width: 600µm; ComponentLink1URL: https://datasheet.octopart.com:443/LQG15WZ1N9S02D-Murata-datasheet-150573551.pdf?src-supplier=Newark; ComponentLink1Description: https://datasheet.octopart.com:443/LQG15WZ1N9S02D-Murata-datasheet-150573551.pdf?src-supplier=Newark; ComponentLink2URL: https://datasheet.octopart.com:443/LQG15WZ1N9S02D-Murata-datasheet-141286638.pdf?src-supplier=Ciiva; ComponentLink2Description: https://datasheet.octopart.com:443/LQG15WZ1N9S02D-Murata-datasheet-141286638.pdf?src-supplier=Ciiva; ComponentLink3URL: https://datasheet.octopart.com:443/LQG15WZ1N9S02D-Murata-datasheet-140712736.pdf?src-supplier=Ciiva; ComponentLink3Description: https://datasheet.octopart.com:443/LQG15WZ1N9S02D-Murata-datasheet-140712736.pdf?src-supplier=Ciiva; ComponentLink4URL: https://datasheet.octopart.com:443/LQG15WZ1N9S02D-Murata-datasheet-138753858.pdf?src-supplier=Ciiva; ComponentLink4Description: https://datasheet.octopart.com:443/LQG15WZ1N9S02D-Murata-datasheet-138753858.pdf?src-supplier=Ciiva; ComponentLink5URL: https://datasheet.octopart.com:443/LQG15WZ1N9S02D-Murata-datasheet-145449678.pdf?src-supplier=Geoflip; ComponentLink5Description: https://datasheet.octopart.com:443/LQG15WZ1N9S02D-Murata-datasheet-145449678.pdf?src-supplier=Geoflip; ComponentLink6URL: http://sigma.octopart.com:80/reach_statement/Murata-company-16.pdf?src-supplier=Compliance+Statements; ComponentLink6Description: http://sigma.octopart.com:80/reach_statement/Murata-company-16.pdf?src-supplier=Compliance+Statements; Supplier 1: DigiKey; Supplier Part Number 1: 490-LQG15WZ1N9S02DCT-ND
L5 = IND 4.7uH: Inductor Power Shielded Multi-Layer 4.7uH 20% 2MHz Ferrite 0.12A 0.65Ohm DCR 0603 T/R; Manufacturer: TDK; Manufacturer Part Number: MLZ1608M4R7WT000; Manufacturer Lifecycle Status: PRODUCTION; DC Resistance (DCR): 650mΩ; Number of Circuits: 1; Saturation Current: 120mA; Self Resonant Frequency: 80MHz; Shielding: Yes; Supplier: Avnet; Supplier Part Number: 46W4780; RoHS: Compliant; Category: Fixed Inductors; Stock: 50; Pricing: 1=0.063, 30=0.058, 50=0.054, 100=0.05 (USD); Case/Package: 0603; Case Code (Imperial): 0603; Case Code (Metric): 1608; Core Material: Ferrite; Current Rating: 350mA; Height: 800µm; Height - Seated (Max): 939.8µm; Length: 1.6mm; Lifecycle Status: Production; Max Length: 1.75mm; Max Operating Temperature: 125°C; Max Width: 950µm; Min Length: 1.45mm; Min Operating Temperature: -55°C; Min Width: 650µm; Mounting Technology: Surface Mount; Number of Terminals: 2; Packaging: Tape & Reel (TR); REACH SVHC: Yes; RMS Current (Irms): 350mA; Schedule B: 8504500000, 8504500000|8504500000|8504500000|8504500000|8504500000; ESR: 650mΩ; Test Frequency: 2MHz; Tolerance: 20%; Width: 800µm; ComponentLink1URL: https://datasheet.octopart.com:443/MLZ1608M4R7WT000-TDK-datasheet-155327068.pdf?src-supplier=ODG+(Origin+Data+Global); ComponentLink1Description: https://datasheet.octopart.com:443/MLZ1608M4R7WT000-TDK-datasheet-155327068.pdf?src-supplier=ODG+(Origin+Data+Global); ComponentLink2URL: https://datasheet.octopart.com:443/MLZ1608M4R7WT000-TDK-datasheet-170576133.pdf?src-supplier=Newark; ComponentLink2Description: https://datasheet.octopart.com:443/MLZ1608M4R7WT000-TDK-datasheet-170576133.pdf?src-supplier=Newark; ComponentLink3URL: https://datasheet.octopart.com:443/MLZ1608M4R7WT000-TDK-datasheet-12356712.pdf?src-supplier=Newark; ComponentLink3Description: https://datasheet.octopart.com:443/MLZ1608M4R7WT000-TDK-datasheet-12356712.pdf?src-supplier=Newark; ComponentLink4URL: https://datasheet.octopart.com:443/MLZ1608M4R7WT000-TDK-datasheet-136874818.pdf?src-supplier=TME; ComponentLink4Description: https://datasheet.octopart.com:443/MLZ1608M4R7WT000-TDK-datasheet-136874818.pdf?src-supplier=TME; ComponentLink5URL: https://datasheet.octopart.com:443/MLZ1608M4R7WT000-TDK-datasheet-62316133.pdf?src-supplier=Future+Electronics; ComponentLink5Description: https://datasheet.octopart.com:443/MLZ1608M4R7WT000-TDK-datasheet-62316133.pdf?src-supplier=Future+Electronics; Supplier 1: DigiKey; Supplier Part Number 1: 445-6390-1-ND
R16 = RES 100R 0603: Fixed Resistor, Metal Glaze/thick Film, 0.1W, 100ohm, 75V, 1% +/-Tol, 100ppm/Cel, Surface Mount, 0603; Manufacturer: Yageo; Manufacturer Part Number: RC0603FR-07100RL; Additional Feature: LASER TRIMMABLE; Power: 100mW; Rated Temperature: 70°C; Temperature Coefficient: 100ppm/°C; Package Height: 0.45mm; Package Length: 1.6mm; Package Width: 0.8mm; Supplier: Digikey; Supplier Part Number: 311-100HRCT-ND; RoHS: Yes; Category: Chip SMD Resistors; Stock: 2134400; Pricing: 1=0.1, 10=0.019, 50=0.0112, 100=0.0093, 500=0.00622, 1000=0.00532, 5000=0.00382, 10000=0.00335, 25000=0.00287, 35000=0.00278, 50000=0.00257, 125000=0.00232 (USD); Mounting Technology: Surface Mount; Pins: 2; Package Shape: Rectangular; Case/Package: 0603; Terminal Finish: Nickel; Min Operating Temperature: -55°C; Max Operating Temperature: 155°C; Tolerance: 1%; JESD-609 Code: e3; Resistor Type: FIXED RESISTOR; Construction: Chip; Package Style: SMTMeter; Packaging: Tape and Reel; Technology: METAL GLAZE/THICK FILM; Termination: Wraparound; Working Voltage: 75V; Reach SVHC Compliant: Yes; RoHS Compliant: Yes; ComponentLink1URL: https://datasheet.ciiva.com:443/pdfs/VipMasterIC/IC/YAGO/YAGO-S-A0008145938/YAGO-S-A0008145938-1.pdf?src-supplier=IHS+Markit; ComponentLink1Description: https://datasheet.ciiva.com:443/pdfs/VipMasterIC/IC/YAGO/YAGO-S-A0008145938/YAGO-S-A0008145938-1.pdf?src-supplier=IHS+Markit
R21 = RES 1Ohm 0603: Fixed Resistor, Metal Glaze/thick Film, 0.1W, 4700ohm, 75V, 1% +/-Tol, 100ppm/Cel, Surface Mount, 0603; Manufacturer: Yageo; Manufacturer Part Number: RC0603FR-074K7L; Additional Feature: LASER TRIMMABLE; Power: 100mW; Rated Temperature: 70°C; Temperature Coefficient: 100ppm/°C; Package Height: 0.45mm; Package Length: 1.6mm; Package Width: 0.8mm; Supplier: Digikey; Supplier Part Number: 311-4.70KHRCT-ND; RoHS: Yes; Category: Chip SMD Resistors; Stock: 2101497; Pricing: 1=0.1, 10=0.019, 50=0.0112, 100=0.0093, 500=0.00622, 1000=0.00532, 5000=0.00382, 10000=0.00335, 25000=0.00287, 35000=0.00278, 50000=0.00257, 125000=0.00232 (USD); Mounting Technology: Surface Mount; Pins: 2; Package Shape: Rectangular; Case/Package: 0603; Terminal Finish: Nickel; Min Operating Temperature: -55°C; Max Operating Temperature: 155°C; Tolerance: 1%; JESD-609 Code: e3; Resistor Type: FIXED RESISTOR; Construction: Chip; Package Style: SMTMeter; Packaging: Tape and Reel; Technology: METAL GLAZE/THICK FILM; Termination: Wraparound; Working Voltage: 75V; Reach SVHC Compliant: Yes; RoHS Compliant: Yes; ComponentLink1URL: https://datasheet.ciiva.com:443/pdfs/VipMasterIC/IC/YAGO/YAGO-S-A0008145938/YAGO-S-A0008145938-1.pdf?src-supplier=IHS+Markit; ComponentLink1Description: https://datasheet.ciiva.com:443/pdfs/VipMasterIC/IC/YAGO/YAGO-S-A0008145938/YAGO-S-A0008145938-1.pdf?src-supplier=IHS+Markit; ComponentLink2URL: https://datasheet.ciiva.com/46440/1868787-46440909.pdf?src-supplier=Element14; ComponentLink2Description: https://datasheet.ciiva.com/46440/1868787-46440909.pdf?src-supplier=Element14; ComponentLink3URL: https://datasheet.ciiva.com/7660/38590-7660794.pdf?src-supplier=Element14; ComponentLink3Description: https://datasheet.ciiva.com/7660/38590-7660794.pdf?src-supplier=Element14; ComponentLink4URL: https://datasheet.ciiva.com/7746/1868787-7746365.pdf?src-supplier=Element14; ComponentLink4Description: https://datasheet.ciiva.com/7746/1868787-7746365.pdf?src-supplier=Element14; ComponentLink5URL: https://datasheet.ciiva.com/7746/1738695-7746366.pdf?src-supplier=Element14; ComponentLink5Description: https://datasheet.ciiva.com/7746/1738695-7746366.pdf?src-supplier=Element14; ComponentLink6URL: https://datasheet.ciiva.com/22747/443971-22747528.pdf?src-supplier=Element14; ComponentLink6Description: https://datasheet.ciiva.com/22747/443971-22747528.pdf?src-supplier=Element14; Supplier 1: DigiKey; Supplier Part Number 1: 13-RT0603CRE071R91LCT-ND
R22 = RES 4.7K 0603: Fixed Resistor, Metal Glaze/thick Film, 0.1W, 4700ohm, 75V, 1% +/-Tol, 100ppm/Cel, Surface Mount, 0603; Manufacturer: Yageo; Manufacturer Part Number: RC0603FR-074K7L; Additional Feature: LASER TRIMMABLE; Power: 100mW; Rated Temperature: 70°C; Temperature Coefficient: 100ppm/°C; Package Height: 0.45mm; Package Length: 1.6mm; Package Width: 0.8mm; Supplier: Digikey; Supplier Part Number: 311-4.70KHRCT-ND; RoHS: Yes; Category: Chip SMD Resistors; Stock: 2101497; Pricing: 1=0.1, 10=0.019, 50=0.0112, 100=0.0093, 500=0.00622, 1000=0.00532, 5000=0.00382, 10000=0.00335, 25000=0.00287, 35000=0.00278, 50000=0.00257, 125000=0.00232 (USD); Mounting Technology: Surface Mount; Pins: 2; Package Shape: Rectangular; Case/Package: 0603; Terminal Finish: Nickel; Min Operating Temperature: -55°C; Max Operating Temperature: 155°C; Tolerance: 1%; JESD-609 Code: e3; Resistor Type: FIXED RESISTOR; Construction: Chip; Package Style: SMTMeter; Packaging: Tape and Reel; Technology: METAL GLAZE/THICK FILM; Termination: Wraparound; Working Voltage: 75V; Reach SVHC Compliant: Yes; RoHS Compliant: Yes; ComponentLink1URL: https://datasheet.ciiva.com:443/pdfs/VipMasterIC/IC/YAGO/YAGO-S-A0008145938/YAGO-S-A0008145938-1.pdf?src-supplier=IHS+Markit; ComponentLink1Description: https://datasheet.ciiva.com:443/pdfs/VipMasterIC/IC/YAGO/YAGO-S-A0008145938/YAGO-S-A0008145938-1.pdf?src-supplier=IHS+Markit; ComponentLink2URL: https://datasheet.ciiva.com/46440/1868787-46440909.pdf?src-supplier=Element14; ComponentLink2Description: https://datasheet.ciiva.com/46440/1868787-46440909.pdf?src-supplier=Element14; ComponentLink3URL: https://datasheet.ciiva.com/7660/38590-7660794.pdf?src-supplier=Element14; ComponentLink3Description: https://datasheet.ciiva.com/7660/38590-7660794.pdf?src-supplier=Element14; ComponentLink4URL: https://datasheet.ciiva.com/7746/1868787-7746365.pdf?src-supplier=Element14; ComponentLink4Description: https://datasheet.ciiva.com/7746/1868787-7746365.pdf?src-supplier=Element14; ComponentLink5URL: https://datasheet.ciiva.com/7746/1738695-7746366.pdf?src-supplier=Element14; ComponentLink5Description: https://datasheet.ciiva.com/7746/1738695-7746366.pdf?src-supplier=Element14; ComponentLink6URL: https://datasheet.ciiva.com/22747/443971-22747528.pdf?src-supplier=Element14; ComponentLink6Description: https://datasheet.ciiva.com/22747/443971-22747528.pdf?src-supplier=Element14; Supplier 1: DigiKey; Supplier Part Number 1: 311-4.70KHRDKR-ND
SW1 = PTS526 SK15 SMTR2 LFS: Switch Tactile SPST N.O. 0.05A 12VDC 200000Cycles Gull Wing Surface Mount T/R; Manufacturer: C&K Components; Contact Current Rating: 50mA; Contact Resistance: 100mΩ; Life (Cycles): 200kcycles; Number of Positions: 2; Voltage Rating (DC): 12V; Supplier: DigiKey; Supplier Part Number: CKN12221-1-ND; Manufacturer Part Number: PTS526 SK15 SMTR2 LFS; RoHS: Compliant; Category: Tactile Switches; Stock: 26301; Pricing: 1=0.14, 10=0.127, 25=0.1192, 100=0.1073, 250=0.09968, 500=0.09408, 1000=0.08878 (USD); Height: 1.65mm; Lifecycle Status: Production; Max Operating Temperature: 70°C; Min Operating Temperature: -20°C; REACH SVHC: Yes; Schedule B: 8536509065, 8536509065|8536509065|8536509065|8536509065|8536509065; ComponentLink1URL: https://datasheet.octopart.com:443/PTS526SK15SMTR2LFS-C%26K-Components-datasheet-166147767.pdf?src-supplier=TME; ComponentLink1Description: https://datasheet.octopart.com:443/PTS526SK15SMTR2LFS-C%26K-Components-datasheet-166147767.pdf?src-supplier=TME; ComponentLink2URL: https://datasheet.octopart.com:443/PTS526-SK15-SMTR2-LFS-C%26K-Components-datasheet-168052134.pdf?src-supplier=Newark; ComponentLink2Description: https://datasheet.octopart.com:443/PTS526-SK15-SMTR2-LFS-C%26K-Components-datasheet-168052134.pdf?src-supplier=Newark; ComponentLink3URL: https://datasheet.octopart.com:443/PTS526SK15SMTR2LFS-C%26K-Components-datasheet-154834492.pdf?src-supplier=Electro+Sonic; ComponentLink3Description: https://datasheet.octopart.com:443/PTS526SK15SMTR2LFS-C%26K-Components-datasheet-154834492.pdf?src-supplier=Electro+Sonic; ComponentLink4URL: https://datasheet.octopart.com:443/PTS526SK15SMTR2LFS-C%26K-Components-datasheet-138817219.pdf?src-supplier=Future+Electronics; ComponentLink4Description: https://datasheet.octopart.com:443/PTS526SK15SMTR2LFS-C%26K-Components-datasheet-138817219.pdf?src-supplier=Future+Electronics